# EAGLE design DCS Controller V2 (EAGLE 9.2.2)
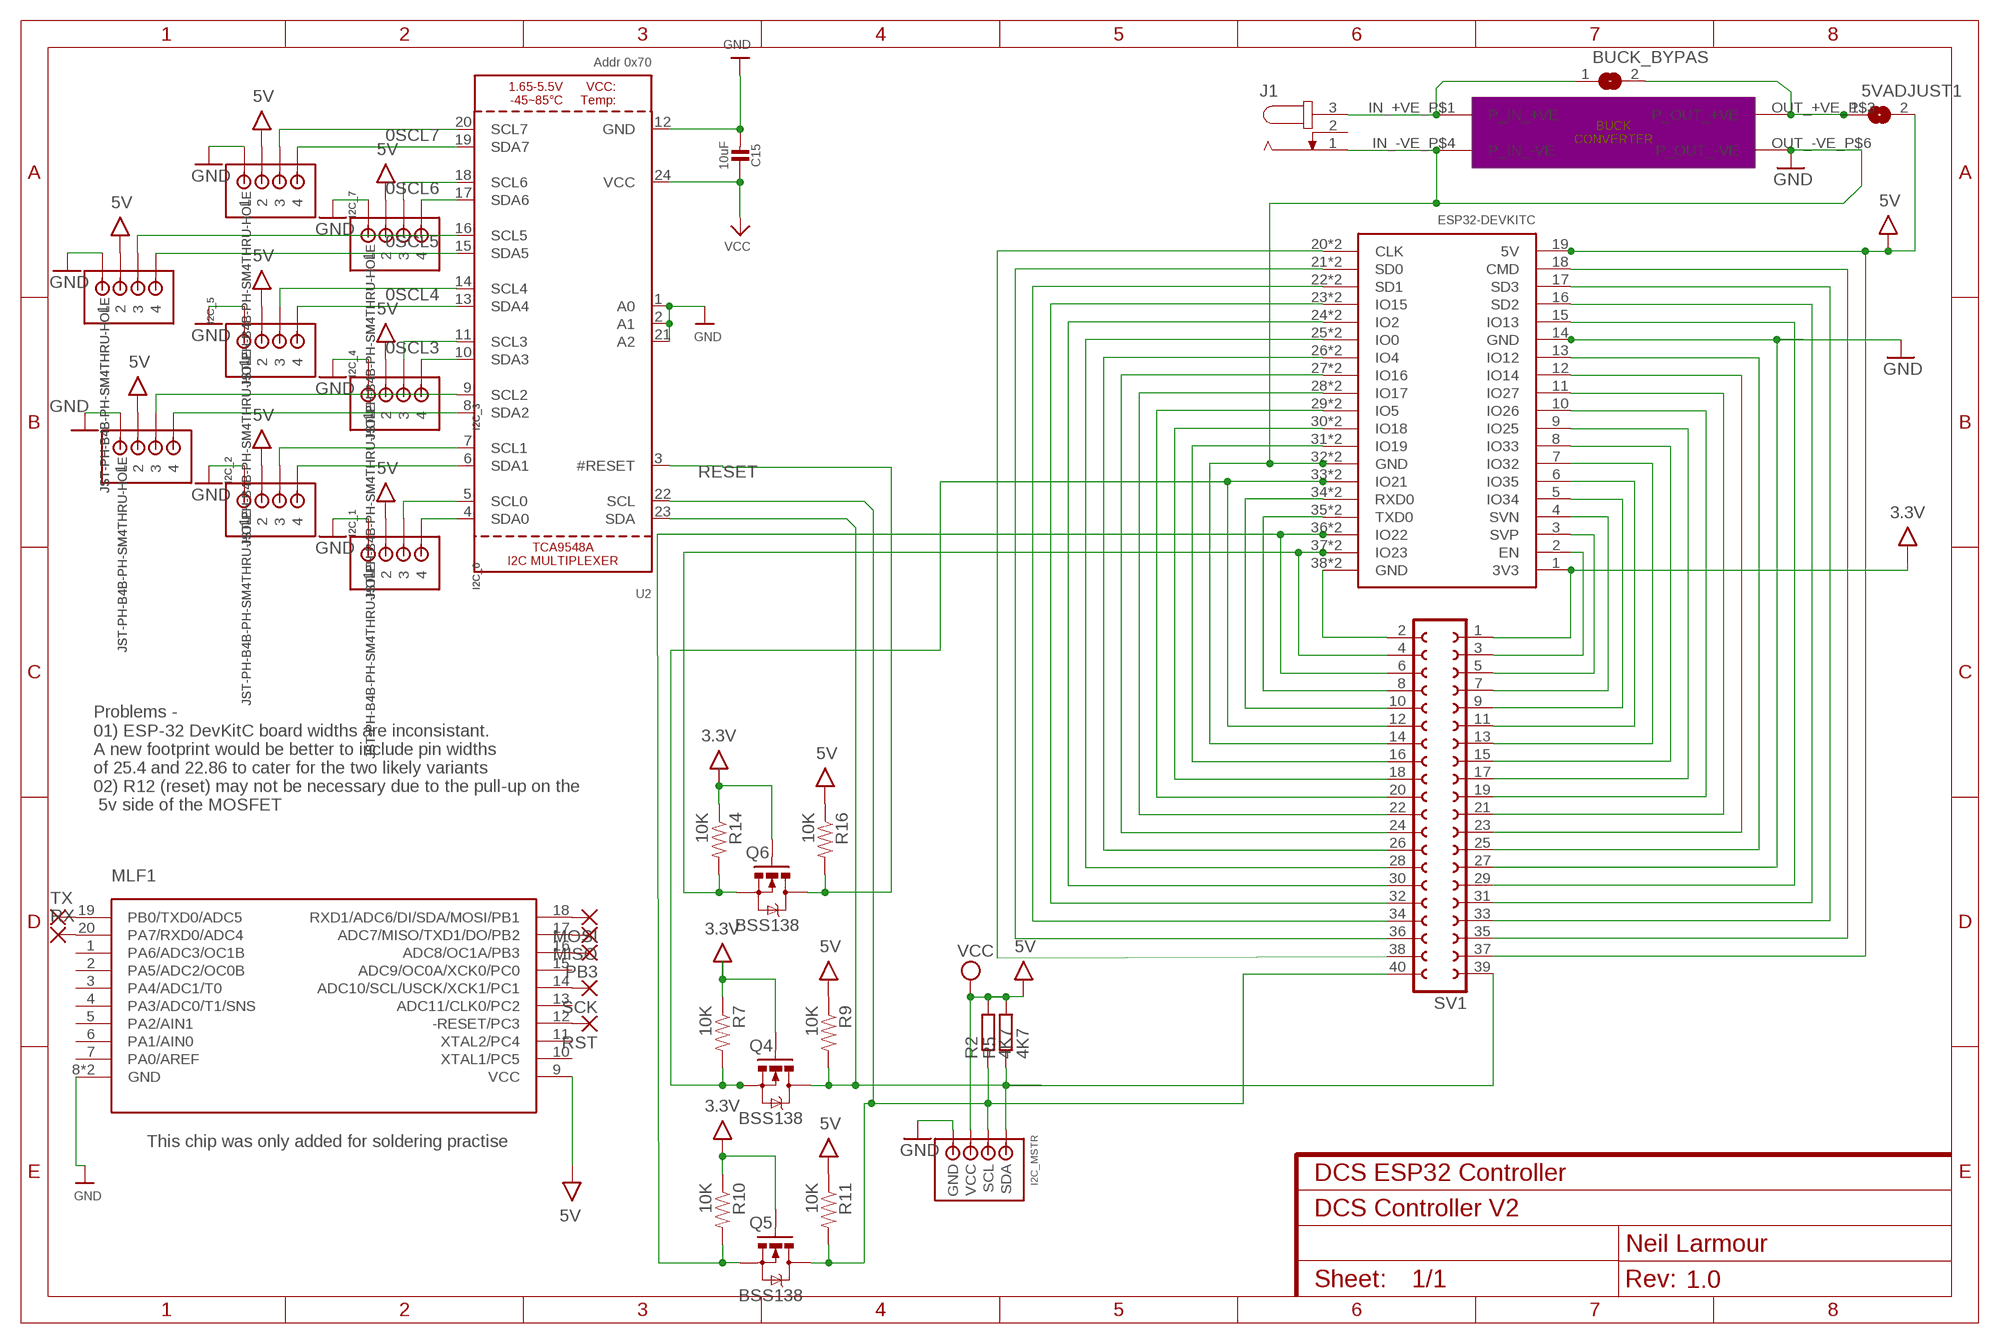
[diagram p0: schematic, sheet 1]
FRAME1 (FRAME-A4L): CNAME: DCS ESP32 Controller; CREVISION: 1.0; DESIGNER: Neil Larmour

## Parts
5VADJUST1  SJ  [SJ]
BUCK_BYPAS  SJ  [SJ]
C15  10uF  CAP_CERAMIC0805-NOOUTLINE  [0805-NO]
I2C_0  JST-PH-B4B-PH-SM4THRU-HOLE  [B4B-PH-SOLDER]
I2C_1  JST-PH-B4B-PH-SM4THRU-HOLE  [B4B-PH-SOLDER]
I2C_2  JST-PH-B4B-PH-SM4THRU-HOLE  [B4B-PH-SOLDER]
I2C_3  JST-PH-B4B-PH-SM4THRU-HOLE  [B4B-PH-SOLDER]
I2C_4  JST-PH-B4B-PH-SM4THRU-HOLE  [B4B-PH-SOLDER]
I2C_5  JST-PH-B4B-PH-SM4THRU-HOLE  [B4B-PH-SOLDER]
I2C_6  JST-PH-B4B-PH-SM4THRU-HOLE  [B4B-PH-SOLDER]
I2C_7  JST-PH-B4B-PH-SM4THRU-HOLE  [B4B-PH-SOLDER]
I2C_MSTR  I2C_JST_CONNECTORTHROUGH_HOLE  [B4B-PH-SOLDER]
J1  JACK-PLUG0  [SPC4077]
MISO  1,6/0,9  [1,6/0,9]
MLF1  ATTINY1634MLF20  [MLF20]
MOSI  1,6/0,9  [1,6/0,9]
PB3  1,6/0,9  [1,6/0,9]
Q4  BSS138  MOSFET-NCHANNELSMD  [SOT23-3]
Q5  BSS138  MOSFET-NCHANNELSMD  [SOT23-3]
Q6  BSS138  MOSFET-NCHANNELSMD  [SOT23-3]
R2  4K7  R-EU_R0805  [R0805]
R5  4K7  R-EU_R0805  [R0805]
R7  10K  RESISTOR0603-RES  [0603-RES]
R9  10K  RESISTOR0603-RES  [0603-RES]
R10  10K  RESISTOR0603-RES  [0603-RES]
R11  10K  RESISTOR0603-RES  [0603-RES]
R14  10K  RESISTOR0603-RES  [0603-RES]
R16  10K  RESISTOR0603-RES  [0603-RES]
RST  1,6/0,9  [1,6/0,9]
RX  1,6/0,9  [1,6/0,9]
SCK  1,6/0,9  [1,6/0,9]
SV1  FE20-2  [FE20-2]
TX  1,6/0,9  [1,6/0,9]
U2  Addr 0x70  TCA9548A  [TSSOP24]
U$26  EBAY_BUCK_CONVERTERMODULE  [BUCK_CONVERTER]
U$34  ESP32DEVKITC  [ESP32-DEVKITC]

## Nets
0SCL1: I2C_2.P3 U2.9(SCL2)
0SCL3: I2C_3.P3 U2.11(SCL3)
0SCL4: I2C_4.P3 U2.14(SCL4)
0SCL5: I2C_5.P3 U2.16(SCL5)
0SCL6: I2C_6.P3 U2.18(SCL6)
0SCL7: I2C_7.P3 U2.20(SCL7)
3.3V [power]: SV1.1 U$34.1(3V3)
3V3 [power]: Q4.1(G) Q5.1(G) Q6.1(G) R7.1 R10.1 R14.1 ; supply symbol labelled 3.3V
5V [power]: 5VADJUST1.2 C15.1 I2C_0.P2 I2C_1.P2 I2C_2.P2 I2C_3.P2 I2C_4.P2 I2C_5.P2 I2C_6.P2 I2C_7.P2 MLF1.9(VCC) R9.1 R11.1 R16.1 SV1.37 U2.24(VCC) U$34.19(5V) ; supply symbol labelled VCC
GND [power]: C15.2 I2C_0.P1 I2C_1.P1 I2C_2.P1 I2C_3.P1 I2C_4.P1 I2C_5.P1 I2C_6.P1 I2C_7.P1 I2C_MSTR.P1(GND) J1.1 MLF1.8(GND) MLF1.GND SV1.14 SV1.27 U2.1(A0) U2.2(A1) U2.12(GND) U2.21(A2) U$26.IN_-VE_P$4(P_IN_-VE) U$26.OUT_-VE_P$6(P_OUT_-VE) U$34.14(GND) U$34.32(GND) U$34.GND_32(GND)
I2C_0: I2C_MSTR.P4(SDA) Q4.3(D) R5.1 R9.2 SV1.39 U2.23(SDA)
I2C_1: I2C_MSTR.P3(SCL) Q5.3(D) R2.1 R11.2 SV1.40 U2.22(SCL)
N$1: SV1.3 U$34.2(EN)
N$2: SV1.5 U$34.3(SVP)
N$3: SV1.7 U$34.4(SVN)
N$4: SV1.9 U$34.5(IO34)
N$5: SV1.11 U$34.6(IO35)
N$6: SV1.13 U$34.7(IO32)
N$7: SV1.15 U$34.8(IO33)
N$8: SV1.17 U$34.9(IO25)
N$9: SV1.19 U$34.10(IO26)
N$10: SV1.21 U$34.11(IO27)
N$11: SV1.23 U$34.12(IO14)
N$12: SV1.25 U$34.13(IO12)
N$13: SV1.29 U$34.15(IO13)
N$14: SV1.31 U$34.16(SD2)
N$15: SV1.33 U$34.17(SD3)
N$16: SV1.35 U$34.18(CMD)
N$17: SV1.2 U$34.38(GND) U$34.GND_38(GND)
N$18: SV1.8 U$34.35(TXD0) U$34.TXD0
N$19: SV1.10 U$34.34(RXD0) U$34.RXD0
N$20: SV1.16 U$34.31(IO19) U$34.IO19
N$21: SV1.18 U$34.30(IO18) U$34.IO18
N$22: SV1.20 U$34.29(IO5) U$34.IO5
N$23: SV1.22 U$34.28(IO17) U$34.IO17
N$24: SV1.24 U$34.27(IO16) U$34.IO16
N$25: SV1.26 U$34.26(IO4) U$34.IO4
N$26: SV1.28 U$34.25(IO0) U$34.IO0
N$27: SV1.30 U$34.24(IO2) U$34.IO2
N$28: SV1.32 U$34.23(IO15) U$34.IO15
N$29: SV1.34 U$34.22(SD1) U$34.SD1
N$30: SV1.36 U$34.21(SD0) U$34.SD0
N$31: SV1.38 U$34.20(CLK) U$34.CLK
N$32: MLF1.18(RXD1/ADC6/DI/SDA/MOSI/PB1) MOSI.1(P)
N$33 [power]: BUCK_BYPAS.1 J1.3 U$26.IN_+VE_P$1(P_IN_+VE)
N$34 [power]: 5VADJUST1.1 BUCK_BYPAS.2 U$26.OUT_+VE_P$3(P_OUT_+VE)
N$35: MLF1.12(-RESET/PC3) RST.1(P)
N$36: MLF1.14(ADC10/SCL/USCK/XCK1/PC1) SCK.1(P)
N$37: MISO.1(P) MLF1.17(ADC7/MISO/TXD1/DO/PB2)
N$38: I2C_7.P4 U2.19(SDA7)
N$39: I2C_0.P4 U2.4(SDA0)
N$40: I2C_0.P3 U2.5(SCL0)
N$41: I2C_1.P4 U2.6(SDA1)
N$42: MLF1.16(ADC8/OC1A/PB3) PB3.1(P)
N$43: I2C_1.P3 U2.7(SCL1)
N$44: I2C_2.P4 U2.8(SDA2)
N$45: I2C_6.P4 U2.17(SDA6)
N$46: I2C_5.P4 U2.15(SDA5)
N$47: I2C_4.P4 U2.13(SDA4)
N$48: I2C_3.P4 U2.10(SDA3)
N$49: MLF1.19(PB0/TXD0/ADC5) TX.1(P)
N$50: MLF1.20(PA7/RXD0/ADC4) RX.1(P)
N$64: Q6.2(S) R14.2 SV1.4 U$34.37(IO23) U$34.IO23
RESET: Q6.3(D) R16.2 U2.3(#RESET)
SCL3V1: Q5.2(S) R10.2 SV1.6 U$34.36(IO22) U$34.IO22
SDA3V2: Q4.2(S) R7.2 SV1.12 U$34.33(IO21) U$34.IO21
VCC [power]: I2C_MSTR.P2(VCC) R2.2 R5.2 ; supply symbol labelled 5V
Unconnected: J1.2 MLF1.1(PA6/ADC3/OC1B) MLF1.2(PA5/ADC2/OC0B) MLF1.3(PA4/ADC1/T0) MLF1.4(PA3/ADC0/T1/SNS) MLF1.5(PA2/AIN1) MLF1.6(PA1/AIN0) MLF1.7(PA0/AREF) MLF1.10(XTAL1/PC5) MLF1.11(XTAL2/PC4) MLF1.13(ADC11/CLK0/PC2) MLF1.15(ADC9/OC0A/XCK0/PC0)

## Notes on the sheet
- Problems - 
  01) ESP-32 DevKitC board widths are inconsistant.
  A new footprint would be better to include pin widths
  of 25.4 and 22.86 to cater for the two likely variants
  02) R12 (reset) may not be necessary due to the pull-up on the
   5v side of the MOSFET
- This chip was only added for soldering practise

## Library data of the parts
5VADJUST1 BUCK_BYPAS = jumper:SJ: SMD solder JUMPER
C15 = microbuilder:CAP_CERAMIC: Ceramic Capacitors For new designs, use the packages preceded by an '_' character since they are more reliable: The following footprints should be used on most boards: _0402 - Standard footprint for regular board layouts _0603 - Standard footprint for regular board layouts _0805 - Standard footprint for regular board layouts _1206 - Standard footprint for regular board layouts For extremely tight-pitch boards where space is at a premium, the following 'micro-pitch' footprints can be used (smaller pads, no silkscreen outline, etc.): _0402MP - Micro-pitch footprint for very dense/compact boards _0603MP - Micro-pitch footprint for very dense/compact boards _0805MP - Micro-pitch footprint for very dense/compact boards _1206MP - Micro-pitch footprint for very dense/compact boards
I2C_0 I2C_1-I2C_7 = 000_nl2:JST-PH-B4B-PH-SM4: JST PH 4 Pin (2.00")
I2C_MSTR = 000_nl2:I2C_JST_CONNECTOR
J1 = 000_nl2:JACK-PLUG: DC POWER JACK Power Jack, DC, Right Angle, Through Hole, Rated 5A at 16VDC, PC Terminals Distributor: Farnell (www.Farnell.de) Drawing: 84N1161.pdf / 84N1162.pdf Manufacturer: SPC Technology (www.spctechnology.com) Type: SPC4077 / SPC 4078; OC_FARNELL: unknown; OC_NEWARK: unknown
MISO MOSI PB3 RST RX SCK TX = wirepad:1,6/0,9: THROUGH-HOLE PAD
MLF1 = 000_nl2:ATTINY1634
Q4-Q6 = SparkFun:MOSFET-NCHANNEL
R2 R5 = rcl:R-EU_: RESISTOR, European symbol; SPICEPREFIX: R
R7 R9-R11 R14 R16 = SparkFun:RESISTOR: Resistor Basic schematic elements and footprints for 0603, 1206, and PTH resistors.
SV1 = 000_nl2:FE20-2: FEMALE HEADER; OC_FARNELL: unknown; OC_NEWARK: unknown
U2 = microbuilder:TCA9548A: TCA9548A I2C Multiplexer; SPICEPREFIX: X
U$26 = 000_nl2:EBAY_BUCK_CONVERTER
U$34 = 000_nl2:ESP32DEVKITC

## Net classes
1 power: width 0.4 mm, clearance 0.005 mm

## Board
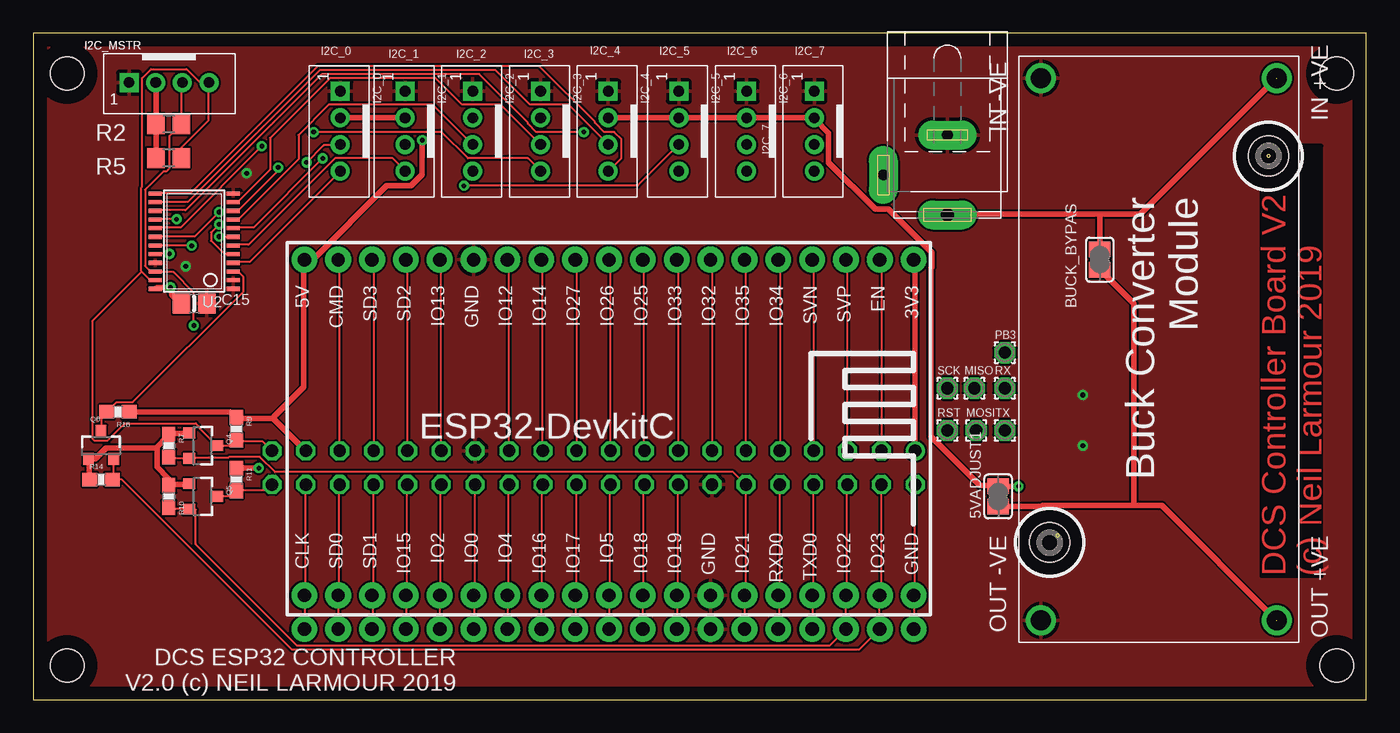
[diagram p1: board, top side]
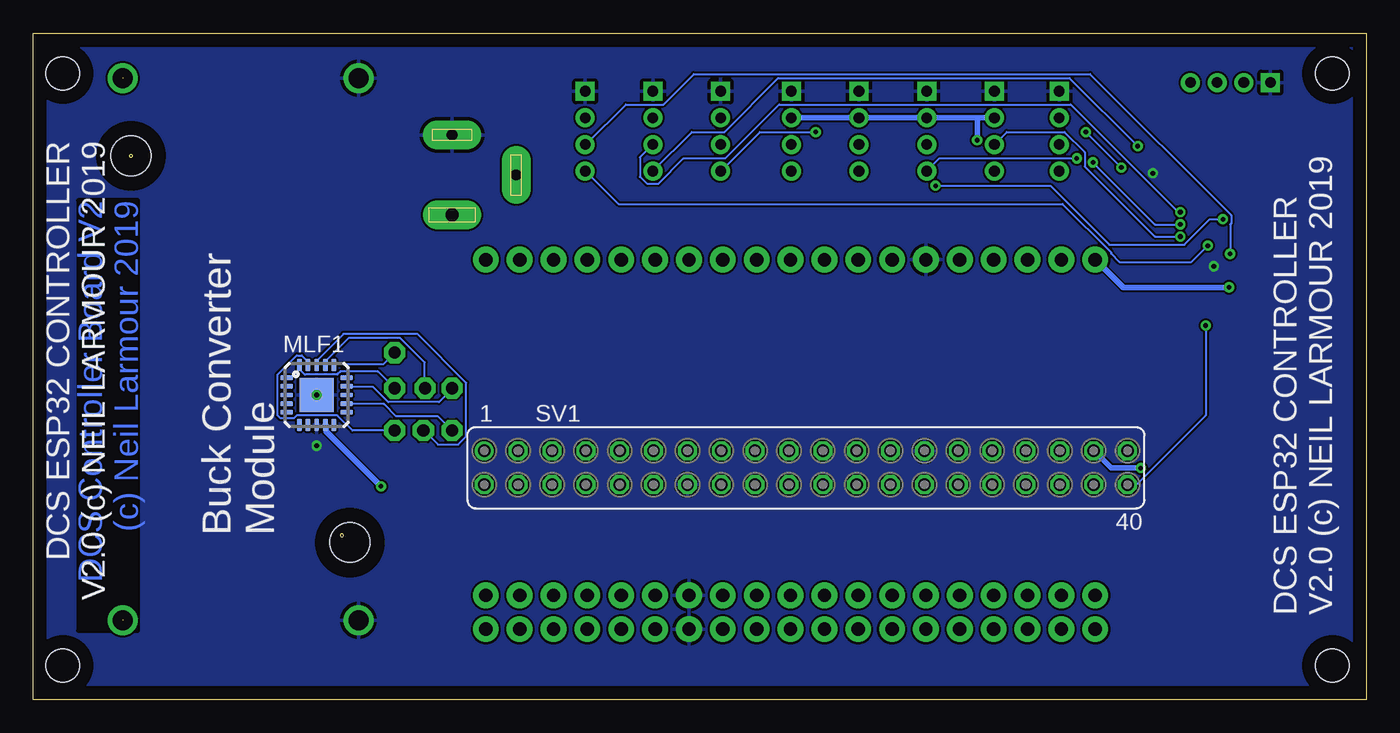
[diagram p2: board, bottom side, seen from below]

Size 100 x 50 mm. Coordinates in mm from the lower left corner, seen from the top.
Outline: 0,0 100,0 100,50 0,50 0,0
Copper layers (1*16): Top 0.035mm / dielectric 1.5mm / Bottom 0.035mm
Design rules "default": minimum track width 6mil, minimum drill 0.35mm, track to track 6mil, track to pad 6mil, pad to pad 6mil, via to via 6mil, smd to smd 6mil, copper to edge 40mil, drill to drill 6mil, minimum pad ring 10mil, minimum via ring 8mil, stop-mask expansion 4mil, vias tented up to drill 0mil, thermal gap 10mil
Holes 2.5 mm at 97.79,2.54 2.54,46.99 2.54,2.54 97.79,46.99

### Footprints (pad centres in the part's own frame; a part is rotated, then mirrored left to right if it is on the bottom)
SJ = smd 1.168 x 1.6: 1 -0.762,0; 2 0.762,0
0805-NO = smd 1.3 x 1.5: 1 -0.95,0; 2 0.95,0
B4B-PH-SOLDER = drill 0.8 pad 1.422 square: P1 -2.98,0.588 | drill 0.8 pad 1.422: P2 -0.98,0.588; P3 1.02,0.588; P4 3.02,0.588
SPC4077 = drill 0.8 pad 2.184 long: 1 -3,0; 2 0,-4.8 | drill 1 pad 2.184 long: 3 3,0
1,6/0,9 = drill 0.914 pad 1.6 octagon: 1 0,0
MLF20 = smd 0.9 x 0.35: 1 -2.25,1.3; 2 -2.25,0.65; 3 -2.25,0; 4 -2.25,-0.65; 5 -2.25,-1.3; 11 2.25,-1.3; 12 2.25,-0.65; 13 2.25,0; 14 2.25,0.65; 15 2.25,1.3 | smd 0.35 x 0.9: 6 -1.3,-2.25; 7 -0.65,-2.25; 8 0,-2.25; 9 0.65,-2.25; 10 1.3,-2.25; 16 1.3,2.25; 17 0.65,2.25; 18 0,2.25; 19 -0.65,2.25; 20 -1.3,2.25 | smd 2.54 x 2.54: GND 0,0
SOT23-3 = smd 0.8 x 0.9: 1 -0.95,-1; 2 0.95,-1; 3 0,1.1
R0805 = smd 1.3 x 1.5: 1 -0.95,0; 2 0.95,0
0603-RES = smd 1.1 x 1: 1 -0.85,0; 2 0.85,0
FE20-2 = drill 0.914: 1 -24.13,1.27 | drill 0.914 octagon: 2 -24.13,-1.27; 3 -21.59,1.27; 4 -21.59,-1.27; 5 -19.05,1.27; 6 -19.05,-1.27; 7 -16.51,1.27; 8 -16.51,-1.27; 9 -13.97,1.27; 10 -13.97,-1.27; 11 -11.43,1.27; 12 -11.43,-1.27; 13 -8.89,1.27; 14 -8.89,-1.27; 15 -6.35,1.27; 16 -6.35,-1.27; 17 -3.81,1.27; 18 -3.81,-1.27; 19 -1.27,1.27; 20 -1.27,-1.27; 21 1.27,1.27; 22 1.27,-1.27; 23 3.81,1.27; 24 3.81,-1.27; 25 6.35,1.27; 26 6.35,-1.27; 27 8.89,1.27; 28 8.89,-1.27; 29 11.43,1.27; 30 11.43,-1.27; 31 13.97,1.27; 32 13.97,-1.27; 33 16.51,1.27; 34 16.51,-1.27; 35 19.05,1.27; 36 19.05,-1.27; 37 21.59,1.27; 38 21.59,-1.27; 39 24.13,1.27; 40 24.13,-1.27
TSSOP24 = smd 0.305 x 0.991: 1 -3.575,-2.918; 2 -2.925,-2.918; 3 -2.275,-2.918; 4 -1.625,-2.918; 5 -0.975,-2.918; 6 -0.325,-2.918; 7 0.325,-2.918; 8 0.975,-2.918; 9 1.625,-2.918; 10 2.275,-2.918; 11 2.925,-2.918; 12 3.575,-2.918; 13 3.575,2.918; 14 2.925,2.918; 15 2.275,2.918; 16 1.625,2.918; 17 0.975,2.918; 18 0.325,2.918; 19 -0.325,2.918; 20 -0.975,2.918; 21 -1.625,2.918; 22 -2.275,2.918; 23 -2.925,2.918; 24 -3.575,2.918
BUCK_CONVERTER = drill 1.5: IN_+VE_P$1 -20.35,8.85; IN_-VE_P$4 -20.35,-8.85; OUT_+VE_P$3 20.35,8.85; OUT_-VE_P$6 20.35,-8.85 | hole 3: -14.5,8.209; 14.5,-8.209
ESP32-DEVKITC = drill 1 pad 1.93: 1 -22.87,-12.69; 2 -20.33,-12.69; 3 -17.79,-12.69; 4 -15.25,-12.69; 5 -12.71,-12.69; 6 -10.17,-12.69; 7 -7.63,-12.69; 8 -5.09,-12.69; 9 -2.55,-12.69; 10 -0.01,-12.69; 11 2.53,-12.69; 12 5.07,-12.69; 13 7.61,-12.69; 14 10.15,-12.69; 15 12.69,-12.69; 16 15.23,-12.69; 17 17.77,-12.69; 18 20.31,-12.69; 19 22.85,-12.69; 20 22.85,12.5; 21 20.31,12.5; 22 17.77,12.5; 23 15.23,12.5; 24 12.69,12.5; 25 10.15,12.5; 26 7.61,12.5; 27 5.07,12.5; 28 2.53,12.5; 29 -0.01,12.5; 30 -2.55,12.5; 31 -5.09,12.5; 32 -7.63,12.5; 33 -10.17,12.5; 34 -12.71,12.5; 35 -15.25,12.5; 36 -17.79,12.5; 37 -20.33,12.5; 38 -22.87,12.5; CLK 22.85,15.04; GND_32 -7.63,15.04; GND_38 -22.87,15.04; IO0 10.15,15.04; IO2 12.69,15.04; IO4 7.61,15.04; IO5 -0.01,15.04; IO15 15.23,15.04; IO16 5.07,15.04; IO17 2.53,15.04; IO18 -2.55,15.04; IO19 -5.09,15.04; IO21 -10.17,15.04; IO22 -17.79,15.04; IO23 -20.33,15.04; RXD0 -12.71,15.04; SD0 20.31,15.04; SD1 17.77,15.04; TXD0 -15.25,15.04

### Placement (x,y rotation side)
5VADJUST1  72.39,15.24 90 top
BUCK_BYPAS  80.01,33.02 270 top
C15  12.06,29.72 0 top
I2C_0  22.45,42.67 270 top
I2C_1  27.3,42.67 270 top
I2C_2  32.38,42.67 270 top
I2C_3  37.47,42.67 270 top
I2C_4  42.55,42.67 270 top
I2C_5  47.85,42.67 270 top
I2C_6  52.93,42.67 270 top
I2C_7  58.01,42.67 270 top
I2C_MSTR  10.16,45.72 0 top
J1  68.58,39.37 270 top
MISO  70.61,23.37 0 top
MLF1  78.74,22.86 0 bottom
MOSI  70.74,20.19 0 top
PB3  72.9,26.04 0 top
Q4  12.7,19.05 270 top
Q5  12.7,15.24 270 top
Q6  5.08,19.05 0 top
R2  10.16,43.18 180 top
R5  10.16,40.64 180 top
R7  10.16,19.05 270 top
R9  15.24,20.32 270 top
R10  10.16,15.24 270 top
R11  15.24,16.51 270 top
R14  5.08,16.51 0 top
R16  6.35,21.59 180 top
RST  68.58,20.19 0 top
RX  72.9,23.37 0 top
SCK  68.58,23.37 0 top
SV1  42.04,17.4 0 bottom
TX  72.9,20.19 0 top
U2  12.06,34.4 90 top
U$26  84.45,26.29 270 top
U$34  43.18,20.32 180 top

### Tracks (layer width: path | path; a pad name or v marks a point on that pad's centre or on a via)
0SCL1
  Top 0.152: U2.9 15.01,36.04 15.39,36.04 19.89,40.54 19.89,42.37 22.17,44.65 29.95,44.65 32.92,41.68 I2C_2.P3
0SCL3
  Top 0.152: U2.11 15.01,37.34 15.32,37.34 17.75,39.78 17.75,42.14 22.25,46.63 30.18,46.63 32.16,44.65 35.05,44.65 38.02,41.68 I2C_3.P3
0SCL4
  Top 0.152: U2.14 9.22,37.34 11.58,37.34 21.49,47.24 34.67,47.24 37.26,44.65 40.16,44.65 43.13,41.68 I2C_4.P3
0SCL5  (via drill 0.35)
  Top 0.152: v10.74,36.04 9.22,36.04 U2.16 | v32.31,38.56 45.34,38.56 48.39,41.6 I2C_5.P3
  Bottom 0.152: v10.74,36.04 11.73,36.04 13.64,34.14 19.28,34.14 23.7,38.56 v32.31,38.56
0SCL6  (via drill 0.35)
  Top 0.152: v13.95,36.58 12.12,34.75 9.22,34.75 U2.18
  Bottom 0.152: v13.95,36.58 14.1,36.58 22.17,44.65 44.04,44.65 48.08,40.62 51.21,40.62 53.11,38.71 53.95,38.71 54.48,39.24 54.48,40.69 53.57,41.6 I2C_6.P3
0SCL7  (via drill 0.35)
  Top 0.152: v10.21,33.45 9.22,33.45 U2.20
  Bottom 0.152: v10.21,33.45 10.21,35.66 10.13,35.74 10.13,36.35 20.73,46.94 50.44,46.94 52.73,44.65 55.55,44.65 58.52,41.68 I2C_7.P3
3.3V
  Top 0.4: U$34.1 66.14,32.92 66.14,18.67 SV1.1
3V3
  Top 0.4: R14.1 4.19,16.54 4.19,17.98 Q6.1 4.34,18.06 4.65,18.06 5.49,18.9 9.3,18.9 | Q5.1 11.66,16.15 10.21,16.15 R10.1 10.13,16.31 10.13,16.61 9.3,17.45 9.3,18.9 | Q4.1 11.66,19.96 10.21,19.96 R7.1 10.06,19.74 9.3,18.97 9.3,18.9
5V  (via drill 0.35)
  Top 0.4: v16.92,17.37 15.24,17.37 R11.1 | 17.98,21.11 15.24,21.11 R9.1 15.09,21.26 14.78,21.57 7.24,21.57 R16.1 | 17.98,21.11 20.42,18.67 SV1.37 | 17.98,21.11 18.06,21.26 20.27,23.47 20.27,32.99 U$34.19 20.5,33.07 21.03,33.07 26.52,38.56 28.35,38.56 29.18,39.4 v29.18,41.99 | U2.24 9.3,30.94 v10.29,30.94 10.36,30.79 10.36,30.4 11.05,29.72 C15.1 | I2C_0.P2 23.09,43.66 27.89,43.66 I2C_1.P2 | v73.91,16 5VADJUST1.2 72.24,16.08 71.02,16.08 67.36,19.74 67.36,32.38 67.44,32.46 67.44,33.53 64.16,36.8 63.17,36.8 59.66,40.31 59.66,42.52 58.67,43.51 I2C_7.P2 58.52,43.66 53.72,43.66 I2C_6.P2 53.49,43.66 48.46,43.66 I2C_5.P2 48.23,43.66 43.2,43.66 I2C_4.P2
  Bottom 0.4: v16.92,17.37 19.13,17.37 20.42,18.67 SV1.37 | U$34.19 20.27,32.99 18.21,30.94 v10.29,30.94 | 29.18,43.66 27.96,43.66 I2C_1.P2 | 29.18,43.66 32.92,43.66 I2C_2.P2 33.15,43.66 38.02,43.66 I2C_3.P2 38.25,43.66 43.13,43.66 I2C_4.P2 | v73.91,16 78.03,20.12 78.03,20.57 MLF1.9 | 29.18,43.66 v29.18,41.99
GND  (via drill 0.35)
  other vias: 11.43,32.51 16,39.5 78.74,22.86 78.74,19.05
  pour Top (isolate 0.064): 0,0 100,0 100,50 0,50
  pour Bottom (isolate 0.064, rank 6): 0,0 100,0 100,50 0,50
I2C_0
  Top 0.152: SV1.39 17.22,19.36 15.24,19.36 R9.2 15.24,19.43 14.86,19.05 Q4.3 12.42,20.42 12.42,20.5 12.19,20.73 6.86,20.73 5.56,19.43 4.57,19.43 4.42,19.58 4.42,28.42 8.12,32.12 | 8.12,32.12 8.69,31.55 9.14,31.55 U2.23 | R5.1 11.12,40.69 11.12,41.45 13.11,43.43 13.11,46.25 I2C_MSTR.P4 13.03,46.25 12.57,46.25 11.51,47.32 8.84,47.32 8.15,46.63 8.15,38.48 8.08,38.41 8.08,32.16 8.12,32.12
I2C_1  (via drill 0.35)
  Top 0.152: Q5.3 14.86,15.24 15.24,15.62 R11.2 15.24,15.7 17.53,15.7 17.91,16.08 SV1.40 | I2C_MSTR.P3 11.12,46.25 11.12,43.28 R2.1 11.05,43.13 10.21,42.29 10.21,39.85 9.98,39.62 9.75,39.62 8.38,38.25 8.38,32.54 8.76,32.16 9.14,32.16 U2.22 9.22,32.08 10.52,32.08 12.04,30.56 v12.04,28.07
  Bottom 0.152: v12.04,28.07 12.04,21.34 17.22,16.15 17.91,16.15 SV1.40
N$1
  Top 0.152: SV1.3 63.63,32.92 63.55,32.99 U$34.2
N$2
  Top 0.152: SV1.5 61.04,18.67 61.04,32.99 U$34.3
N$3
  Top 0.152: U$34.4 58.52,32.92 58.52,18.67 SV1.7
N$4
  Top 0.152: SV1.9 56.01,32.92 55.93,32.99 U$34.5
N$5
  Top 0.152: SV1.11 53.42,18.67 53.42,32.99 U$34.6
N$6
  Top 0.152: U$34.7 50.9,32.92 50.9,18.67 SV1.13
N$7
  Top 0.152: SV1.15 48.39,32.92 48.31,32.99 U$34.8
N$8
  Top 0.152: SV1.17 45.8,18.67 45.8,32.99 U$34.9
N$9
  Top 0.152: U$34.10 43.28,32.92 43.28,18.67 SV1.19
N$10
  Top 0.152: SV1.21 40.77,32.92 40.69,32.99 U$34.11
N$11
  Top 0.152: SV1.23 38.18,18.67 38.18,32.99 U$34.12
N$12
  Top 0.152: U$34.13 35.66,32.92 35.66,18.67 SV1.25
N$13
  Top 0.152: SV1.29 30.56,18.67 30.56,32.99 U$34.15
N$14
  Top 0.152: U$34.16 28.04,32.92 28.04,18.67 SV1.31
N$15
  Top 0.152: SV1.33 25.53,32.92 25.45,32.99 U$34.17
N$16
  Top 0.152: SV1.35 22.94,18.67 22.94,32.99 U$34.18
N$17
  Top 0.152: SV1.2 66.14,16.08 66.14,7.92 66.06,7.85 U$34.38 66.06,7.77 66.06,5.33 U$34.GND_38
N$18
  Top 0.152: SV1.8 58.52,16.08 58.52,7.92 58.45,7.85 U$34.35 58.45,7.77 58.45,5.33 U$34.TXD0
N$19
  Top 0.152: SV1.10 56.01,7.92 55.93,7.85 U$34.34 55.93,7.77 55.93,5.33 U$34.RXD0
N$20
  Top 0.152: SV1.16 48.39,7.92 48.31,7.85 U$34.31 48.31,7.77 48.31,5.33 U$34.IO19
N$21
  Top 0.152: SV1.18 45.8,16.08 45.8,7.85 U$34.30 45.72,7.77 45.72,5.33 U$34.IO18
N$22
  Top 0.152: SV1.20 43.28,16.08 43.28,7.92 43.2,7.85 U$34.29 43.2,7.77 43.2,5.33 U$34.IO5
N$23
  Top 0.152: SV1.22 40.77,7.92 40.69,7.85 U$34.28 40.69,7.77 40.69,5.33 U$34.IO17
N$24
  Top 0.152: SV1.24 38.18,16.08 38.18,7.85 U$34.27 38.1,7.77 38.1,5.33 U$34.IO16
N$25
  Top 0.152: SV1.26 35.66,16.08 35.66,7.92 35.59,7.85 U$34.26 35.59,7.77 35.59,5.33 U$34.IO4
N$26
  Top 0.152: SV1.28 33.15,7.92 33.07,7.85 U$34.25 33.07,7.77 33.07,5.33 U$34.IO0
N$27
  Top 0.152: SV1.30 30.56,16.08 30.56,7.85 U$34.24 30.48,7.77 30.48,5.33 U$34.IO2
N$28
  Top 0.152: SV1.32 28.04,16.08 28.04,7.92 27.96,7.85 U$34.23 27.96,7.77 27.96,5.33 U$34.IO15
N$29
  Top 0.152: SV1.34 25.53,7.92 25.45,7.85 U$34.22 25.45,7.77 25.45,5.33 U$34.SD1
N$30
  Top 0.152: SV1.36 22.94,16.08 22.94,7.85 U$34.21 22.86,7.77 22.86,5.33 U$34.SD0
N$31
  Top 0.152: SV1.38 20.42,16.08 20.42,7.92 20.34,7.85 U$34.20 20.34,7.77 20.34,5.33 U$34.CLK
N$32
  Bottom 0.152: MLF1.18 78.72,25.15 78.72,25.45 76.73,27.43 71.17,27.43 67.51,23.77 67.51,19.74 68.12,19.13 69.65,19.13 70.71,20.19 MOSI.1
N$33  (1 unrouted)
  Top 0.4: 80.01,36.42 83.06,36.42 93.27,46.63 | 80.01,36.42 68.58,36.42 J1.3 | BUCK_BYPAS.1 80.01,36.42
N$34  (1 unrouted)
  Top 0.4: 5VADJUST1.1 75.67,14.48 75.74,14.55 82.55,14.55 | 82.55,14.55 84.66,14.55 93.27,5.94 | BUCK_BYPAS.2 82.55,29.72 82.55,14.55
N$35
  Bottom 0.152: RST.1 69.65,21.26 72.77,21.26 73.69,22.17 76.43,22.17 MLF1.12
N$36
  Bottom 0.152: MLF1.14 76.43,23.47 74.52,23.47 73.38,22.33 69.57,22.33 68.58,23.32 SCK.1
N$37
  Bottom 0.152: MLF1.17 78.03,25.15 78.03,25.45 76.35,27.13 72.47,27.13 70.64,25.3 70.64,23.39 MISO.1
N$38  (via drill 0.35)
  Top 0.152: v11.89,34.06 9.22,34.06 U2.19
  Bottom 0.152: v11.89,34.06 13.11,32.84 18.52,32.84 19.13,33.45 19.13,33.53 22.78,37.19 56.08,37.19 58.52,39.62 I2C_7.P4
N$39
  Top 0.152: U2.4 15.01,32.84 16.23,32.84 23.01,39.62 I2C_0.P4
N$40  (via drill 0.35)
  Top 0.152: v13.95,35.66 13.34,35.05 13.34,34.44 14.33,33.45 14.94,33.45 U2.5 | v20.5,40.31 21.79,41.6 23.01,41.6 I2C_0.P3
  Bottom 0.152: v13.95,35.66 15.85,35.66 v20.5,40.31
N$41
  Top 0.152: U2.6 15.01,34.14 16.15,34.14 22.63,40.62 26.98,40.62 27.89,39.7 I2C_1.P4
N$42
  Bottom 0.152: MLF1.16 77.42,25.15 73.76,25.15 72.92,25.98 PB3.1
N$43  (via drill 0.35)
  Top 0.152: v13.95,34.75 14.94,34.75 U2.7
  Bottom 0.152: v13.95,34.75 15.85,34.75 21.11,40.01 21.11,41.07 22.63,42.6 26.98,42.6 27.89,41.68 I2C_1.P3
N$44  (via drill 0.35)
  Top 0.152: v21.72,40.62 16.54,35.43 15.01,35.43 U2.8
  Bottom 0.152: v21.72,40.62 32,40.62 32.92,39.7 I2C_2.P4
N$45  (via drill 0.35)
  Top 0.152: v17.14,41.53 11.05,35.43 9.22,35.43 U2.17
  Bottom 0.152: v17.14,41.53 22.25,46.63 44.12,46.63 48.16,42.6 50.6,42.6 53.49,39.7 I2C_6.P4
N$46  (via drill 0.35)
  Top 0.152: v41.3,42.6 37.72,42.6 37.11,43.2 37.11,43.28 33.45,46.94 21.64,46.94 11.43,36.73 9.22,36.73 U2.15
  Bottom 0.152: v41.3,42.6 45.49,42.6 48.39,39.7 I2C_5.P4
N$47
  Top 0.152: U2.13 9.22,38.02 11.81,38.02 21.34,47.55 37.95,47.55 42.14,43.36 42.14,43.28 42.82,42.6 43.59,42.6 44.12,42.06 44.12,40.62 43.2,39.7 I2C_4.P4
N$48  (via drill 0.35)
  Top 0.152: v18.36,39.93 18.36,39.7 15.39,36.73 15.01,36.73 U2.10 | v21.03,42.6 30.63,42.6 32.61,40.62 37.11,40.62 38.02,39.7 I2C_3.P4
  Bottom 0.152: v21.03,42.6 v18.36,39.93
N$49
  Bottom 0.152: TX.1 76.05,20.19 77.19,21.34 80.24,21.34 80.47,21.11 81.46,21.11 81.69,21.34 81.69,24.38 80.24,25.83 79.86,25.83 79.4,25.38 79.4,25.15 MLF1.19
N$50
  Bottom 0.152: RX.1 74.14,24.61 76.96,24.61 77.19,24.38 79.63,24.38 80.01,24.77 80.01,25.07 MLF1.20
N$64
  Top 0.152: Q6.2 6.02,17.98 6.02,16.61 5.94,16.54 R14.2 6.02,16.54 6.63,16.54 19.43,3.73 61.95,3.73 63.48,5.26 U$34.IO23 63.48,5.33 63.48,7.7 U$34.37 63.55,7.85 63.63,7.92 SV1.4
RESET
  Top 0.152: Q6.3 5.11,20.19 5.11,21.18 5.49,21.57 R16.2 5.56,21.64 6.25,22.33 7.47,22.33 15.77,30.63 15.77,31.7 15.39,32.08 15.01,32.08 U2.3
SCL3V1
  Top 0.152: R10.2 10.21,14.33 11.66,14.33 Q5.2 11.73,14.25 12.19,14.25 12.19,11.66 19.81,4.04 59.74,4.04 60.96,5.26 U$34.IO22 60.96,5.33 60.96,7.7 U$34.36 61.04,7.85 61.04,16.08 SV1.6
SDA3V2
  Top 0.152: R7.2 10.21,18.14 11.66,18.14 Q4.2 11.73,18.14 14.63,18.14 14.71,18.21 16.99,18.21 18.14,17.07 52.5,17.07 53.42,16.15 SV1.12 53.42,16.08 53.42,7.85 U$34.33 53.34,7.77 53.34,5.33 U$34.IO21
VCC
  Top 0.4: R5.2 9.22,40.69 9.22,43.13 R2.2 9.22,43.36 9.22,46.25 I2C_MSTR.P2

### Text on the board
Top: DCS Controller Board V2 / (c) Neil Larmour 2019
Bottom: DCS Controller Board V2 / (c) Neil Larmour 2019
tNames: DCS ESP32 CONTROLLER / V2.0 (c) NEIL LARMOUR 2019
bNames: DCS ESP32 CONTROLLER / V2.0 (c) NEIL LARMOUR 2019 | DCS ESP32 CONTROLLER / V2.0 (c) NEIL LARMOUR 2019